# EAGLE design Adapter-IOX-test (EAGLE 7.7.0)
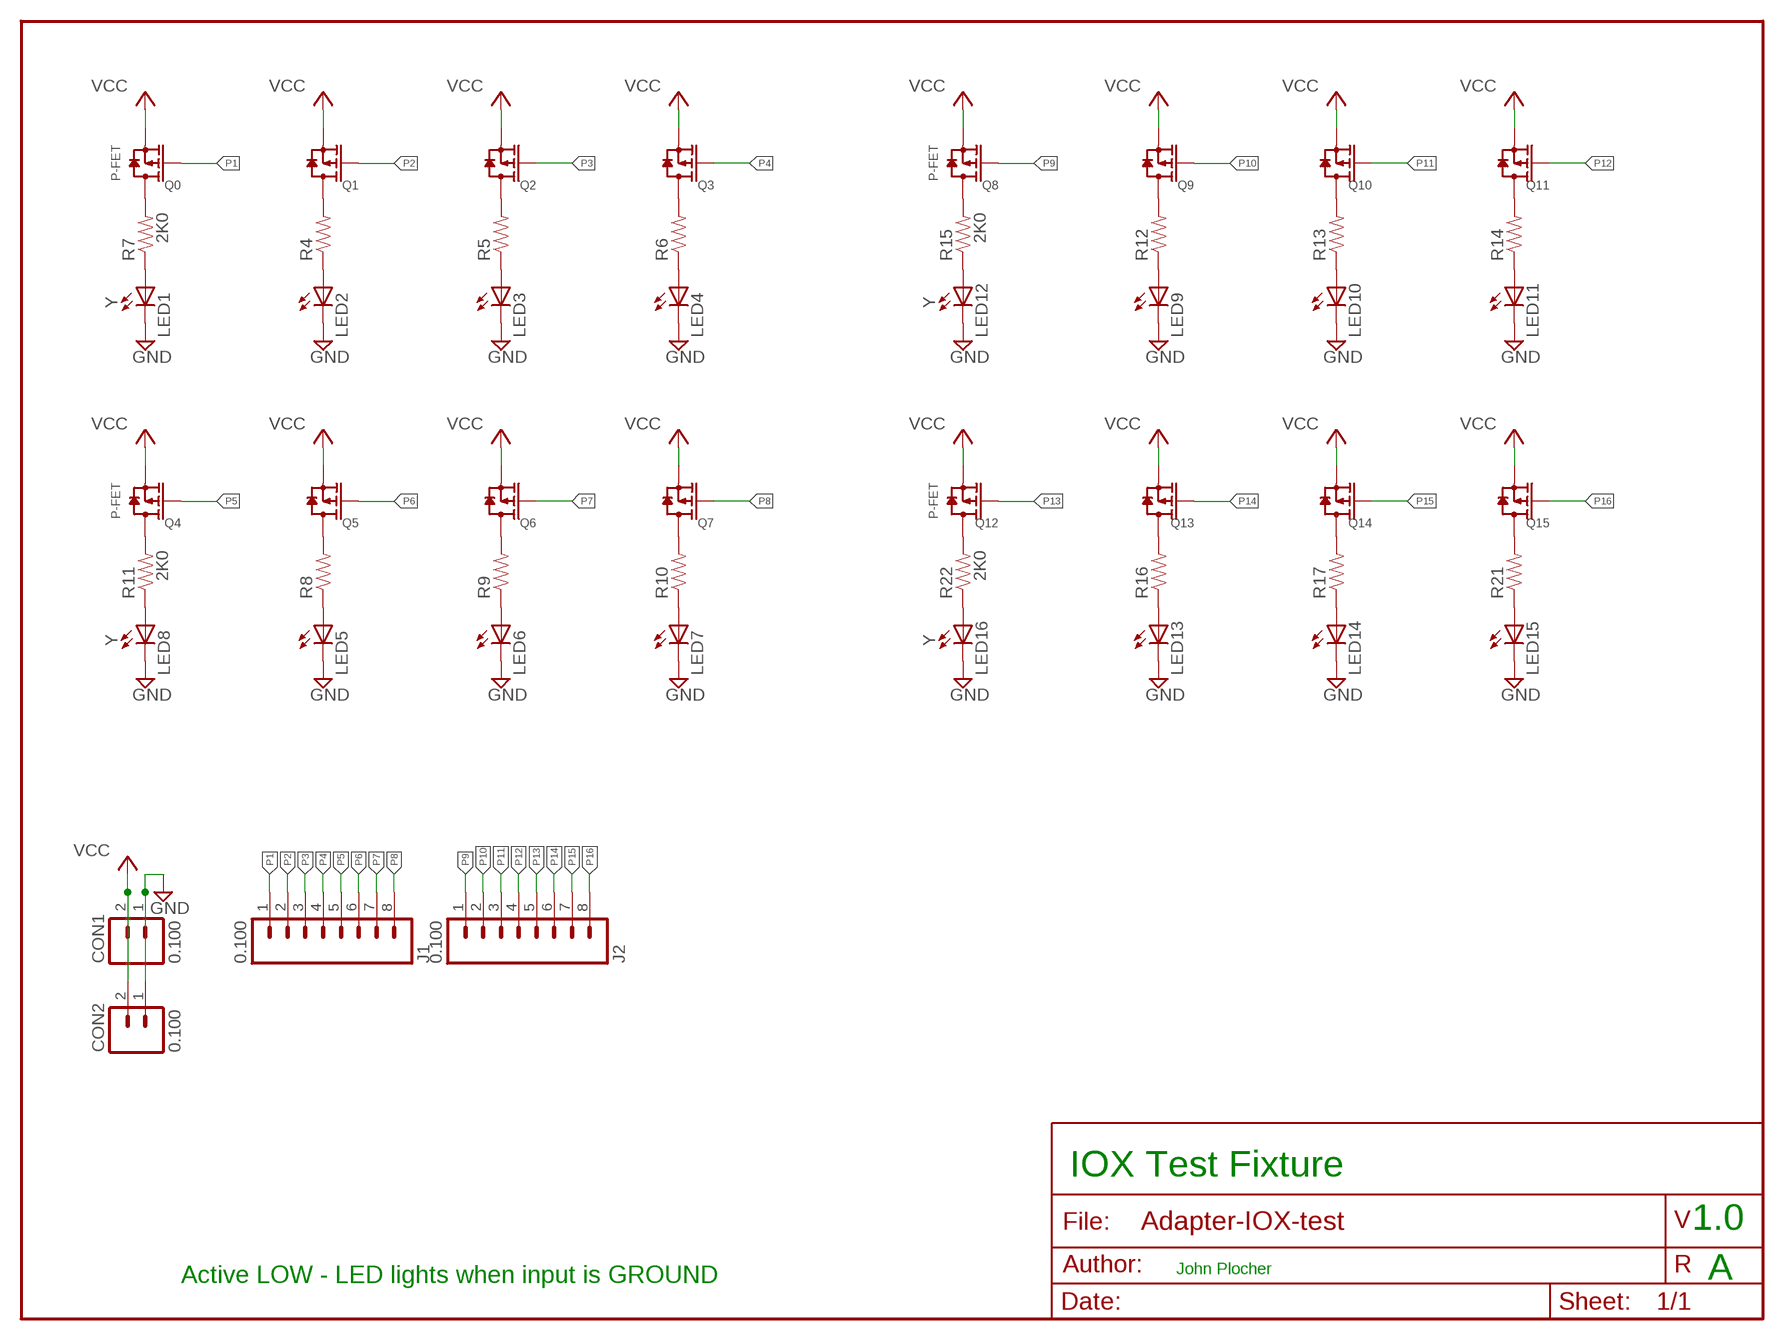
[diagram p0: schematic, sheet 1]

## Parts
CON1  0.100  CONNECTOR-M021X02-LOCK  [1X02_LOCK]
CON2  0.100  CONNECTOR-M021X02-LOCK  [1X02_LOCK]
J1  0.100  CONNECTOR-M08LOCK  [1X08_LOCK]
J2  0.100  CONNECTOR-M08LOCK  [1X08_LOCK]
LED1  Y  LED0603-LED  [0603-LED]
LED2  Y  LED0603-LED  [0603-LED]
LED3  Y  LED0603-LED  [0603-LED]
LED4  Y  LED0603-LED  [0603-LED]
LED5  Y  LED0603-LED  [0603-LED]
LED6  Y  LED0603-LED  [0603-LED]
LED7  Y  LED0603-LED  [0603-LED]
LED8  Y  LED0603-LED  [0603-LED]
LED9  Y  LED0603-LED  [0603-LED]
LED10  Y  LED0603-LED  [0603-LED]
LED11  Y  LED0603-LED  [0603-LED]
LED12  Y  LED0603-LED  [0603-LED]
LED13  Y  LED0603-LED  [0603-LED]
LED14  Y  LED0603-LED  [0603-LED]
LED15  Y  LED0603-LED  [0603-LED]
LED16  Y  LED0603-LED  [0603-LED]
Q0  P-FET  MOSFET-P-044021001  [SOT23]
Q1  P-FET  MOSFET-P-044021001  [SOT23]
Q2  P-FET  MOSFET-P-044021001  [SOT23]
Q3  P-FET  MOSFET-P-044021001  [SOT23]
Q4  P-FET  MOSFET-P-044021001  [SOT23]
Q5  P-FET  MOSFET-P-044021001  [SOT23]
Q6  P-FET  MOSFET-P-044021001  [SOT23]
Q7  P-FET  MOSFET-P-044021001  [SOT23]
Q8  P-FET  MOSFET-P-044021001  [SOT23]
Q9  P-FET  MOSFET-P-044021001  [SOT23]
Q10  P-FET  MOSFET-P-044021001  [SOT23]
Q11  P-FET  MOSFET-P-044021001  [SOT23]
Q12  P-FET  MOSFET-P-044021001  [SOT23]
Q13  P-FET  MOSFET-P-044021001  [SOT23]
Q14  P-FET  MOSFET-P-044021001  [SOT23]
Q15  P-FET  MOSFET-P-044021001  [SOT23]
R4  2K0  R0805-RES  [0805-RES]
R5  2K0  R0805-RES  [0805-RES]
R6  2K0  R0805-RES  [0805-RES]
R7  2K0  R0805-RES  [0805-RES]
R8  2K0  R0805-RES  [0805-RES]
R9  2K0  R0805-RES  [0805-RES]
R10  2K0  R0805-RES  [0805-RES]
R11  2K0  R0805-RES  [0805-RES]
R12  2K0  R0805-RES  [0805-RES]
R13  2K0  R0805-RES  [0805-RES]
R14  2K0  R0805-RES  [0805-RES]
R15  2K0  R0805-RES  [0805-RES]
R16  2K0  R0805-RES  [0805-RES]
R17  2K0  R0805-RES  [0805-RES]
R21  2K0  R0805-RES  [0805-RES]
R22  2K0  R0805-RES  [0805-RES]

## Nets
GND: CON1.1(A) CON2.1(A) LED1.C LED2.C LED3.C LED4.C LED5.C LED6.C LED7.C LED8.C LED9.C LED10.C LED11.C LED12.C LED13.C LED14.C LED15.C LED16.C
N$1: Q4.3(D) R11.2
N$3: Q5.3(D) R8.2
N$4: Q6.3(D) R9.2
N$5: Q7.3(D) R10.2
N$6: LED8.A R11.1
N$7: LED5.A R8.1
N$8: LED6.A R9.1
N$9: LED7.A R10.1
N$10: Q8.3(D) R15.2
N$11: Q9.3(D) R12.2
N$12: Q10.3(D) R13.2
N$13: Q11.3(D) R14.2
N$14: LED12.A R15.1
N$15: LED9.A R12.1
N$23: LED10.A R13.1
N$24: LED11.A R14.1
N$28: Q12.3(D) R22.2
N$29: Q13.3(D) R16.2
N$30: Q14.3(D) R17.2
N$31: Q15.3(D) R21.2
N$32: LED16.A R22.1
N$33: LED13.A R16.1
N$34: LED14.A R17.1
N$35: LED15.A R21.1
N$44: Q0.3(D) R7.2
N$45: Q1.3(D) R4.2
N$46: Q2.3(D) R5.2
N$47: Q3.3(D) R6.2
N$48: LED1.A R7.1
N$49: LED2.A R4.1
N$50: LED3.A R5.1
N$51: LED4.A R6.1
P1 [signals]: J1.1 Q0.1(G)
P2 [signals]: J1.2 Q1.1(G)
P3 [signals]: J1.3 Q2.1(G)
P4 [signals]: J1.4 Q3.1(G)
P5: J1.5 Q4.1(G)
P6: J1.6 Q5.1(G)
P7: J1.7 Q6.1(G)
P8: J1.8 Q7.1(G)
P9 [signals]: J2.1 Q8.1(G)
P10 [signals]: J2.2 Q9.1(G)
P11 [signals]: J2.3 Q10.1(G)
P12 [signals]: J2.4 Q11.1(G)
P13 [signals]: J2.5 Q12.1(G)
P14 [signals]: J2.6 Q13.1(G)
P15 [signals]: J2.7 Q14.1(G)
P16 [signals]: J2.8 Q15.1(G)
VCC [Power]: CON1.2(B) CON2.2(B) Q0.2(S) Q1.2(S) Q2.2(S) Q3.2(S) Q4.2(S) Q5.2(S) Q6.2(S) Q7.2(S) Q8.2(S) Q9.2(S) Q10.2(S) Q11.2(S) Q12.2(S) Q13.2(S) Q14.2(S) Q15.2(S)

## Notes on the sheet
- IOX Test Fixture
- 1.0
- John Plocher
- Active LOW - LED lights when input is GROUND | A

## Library data of the parts
CON1 CON2 = SPCoast:CONNECTOR-M02: PHOENIX CONNECTOR
J1 J2 = SPCoast:CONNECTOR-M08: Header 8 Standard 8-pin 0.1" header. Use with straight break away headers (SKU : PRT-00116), right angle break away headers (PRT-00553), swiss pins (PRT-00743), machine pins (PRT-00117), and female headers (PRT-00115).
LED1-LED16 = SPCoast:LED*
Q0 Q1-Q15 = SPCoast:MOSFET-P: CJ2305：SMD MOSFET P-CH 8V-4.1A
R4-R17 R21 R22 = SPCoast:R*: Resistor Basic schematic elements and footprints for 0603, 1206, and PTH 1/10th watt (small) resistors.

## Net classes
0 default: width 0.254 mm, drill 0.4 mm, clearance 0.127 mm
1 Power: width 0.254 mm, drill 0.4 mm, clearance 0.127 mm
2 signals: width 0.254 mm, drill 0.4 mm, clearance 0.127 mm

## Board
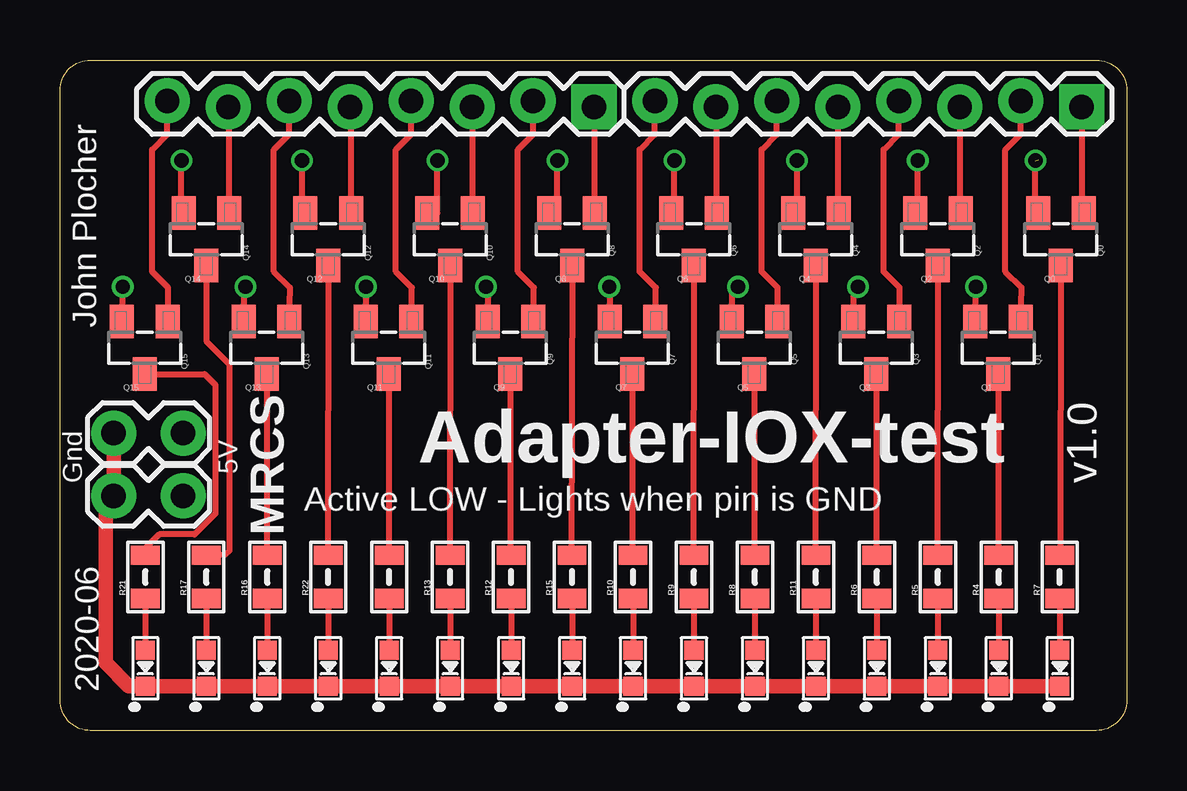
[diagram p1: board, top side]
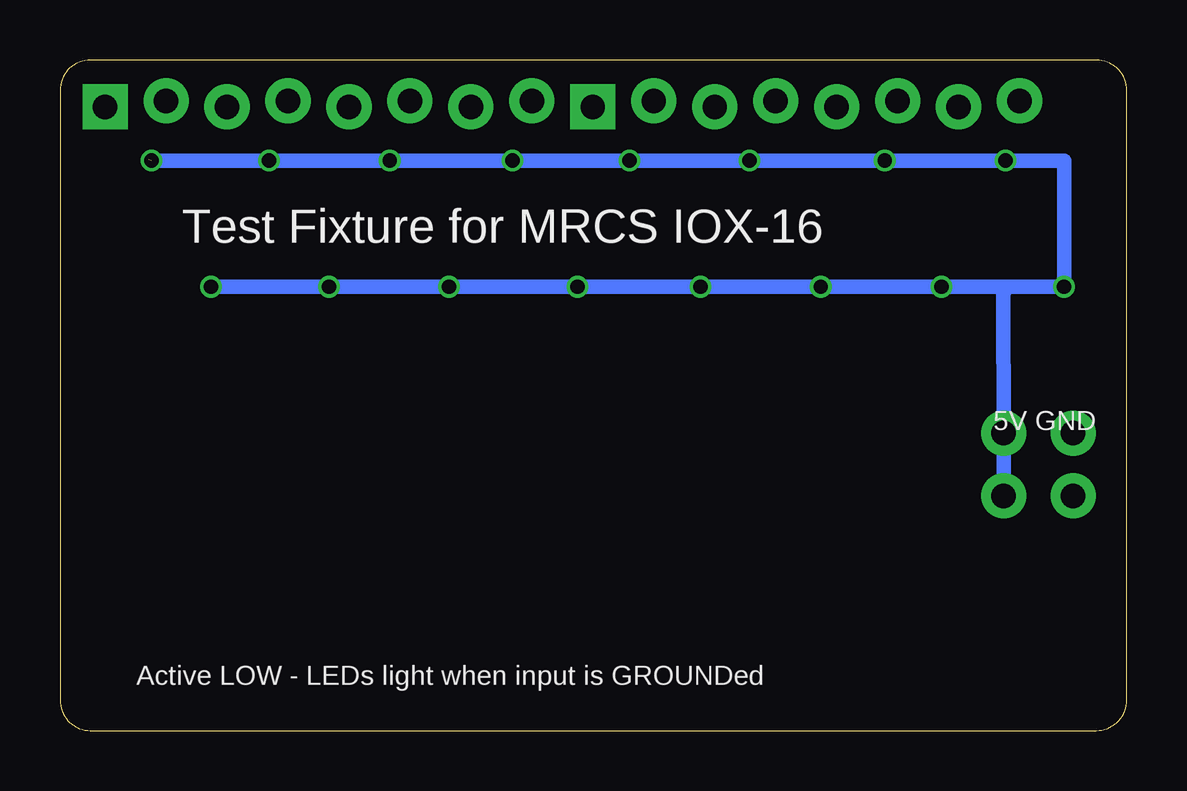
[diagram p2: board, bottom side, seen from below]

Size 44.45 x 27.94 mm. Coordinates in mm from the lower left corner, seen from the top.
Outline: 0,1.27 0,26.67 arc-90 1.27,27.94 43.18,27.94 arc-90 44.45,26.67 44.45,1.27 arc-90 43.18,0 1.27,0 arc-90 0,1.27
Copper layers (1*16): Top 0.035mm / dielectric 1.5mm / Bottom 0.035mm
Design rules "default *": minimum track width 5mil, minimum drill 0.2mm, track to track 5mil, track to pad 5mil, pad to pad 5mil, via to via 5mil, smd to smd 5mil, copper to edge 0.4mm, drill to drill 5mil, minimum pad ring 3mil, minimum via ring 3mil, stop-mask expansion 4mil, vias tented up to drill 0mil, thermal gap 10mil

### Footprints (pad centres in the part's own frame; a part is rotated, then mirrored left to right if it is on the bottom)
1X02_LOCK = drill 1.016 pad 1.88: 1 -0.178,0; 2 2.718,0
1X08_LOCK = drill 1.016 pad 1.88 square: 1 0,0.127 | drill 1.016 pad 1.88: 2 2.54,-0.127; 3 5.08,0.127; 4 7.62,-0.127; 5 10.16,0.127; 6 12.7,-0.127; 7 15.24,0.127; 8 17.78,-0.127
0603-LED = smd 0.8 x 0.8: A 0.75,0; C -0.75,0
SOT23 = smd 1.4 x 1: 1 1.1,-0.95; 2 1.1,0.95; 3 -1.1,0
0805-RES = smd 0.8 x 1.2: 1 -0.9,0; 2 0.9,0

### Placement (x,y rotation side)
CON1  2.41,12.4 0 top
CON2  2.41,9.78 0 top
J1  42.57,26.11 180 top
J2  22.25,26.11 180 top
LED1  41.66,2.59 90 top
LED2  39.12,2.59 90 top
LED3  36.58,2.59 90 top
LED4  34.04,2.59 90 top
LED5  28.96,2.59 90 top
LED6  26.42,2.59 90 top
LED7  23.88,2.59 90 top
LED8  31.5,2.59 90 top
LED9  18.8,2.59 90 top
LED10  16.26,2.59 90 top
LED11  13.72,2.59 90 top
LED12  21.34,2.59 90 top
LED13  8.64,2.59 90 top
LED14  6.1,2.59 90 top
LED15  3.56,2.59 90 top
LED16  11.18,2.59 90 top
Q0  41.71,20.47 90 top
Q1  39.09,15.95 90 top
Q2  36.58,20.47 90 top
Q3  34.01,15.95 90 top
Q4  31.5,20.47 90 top
Q5  28.93,15.95 90 top
Q6  26.42,20.47 90 top
Q7  23.85,15.95 90 top
Q8  21.34,20.47 90 top
Q9  18.77,15.95 90 top
Q10  16.26,20.47 90 top
Q11  13.69,15.95 90 top
Q12  11.18,20.47 90 top
Q13  8.61,15.95 90 top
Q14  6.1,20.47 90 top
Q15  3.53,15.95 90 top
R4  39.12,6.4 90 top
R5  36.58,6.4 90 top
R6  34.04,6.4 90 top
R7  41.66,6.4 90 top
R8  28.96,6.4 90 top
R9  26.42,6.4 90 top
R10  23.88,6.4 90 top
R11  31.5,6.4 90 top
R12  18.8,6.4 90 top
R13  16.26,6.4 90 top
R14  13.72,6.4 90 top
R15  21.34,6.4 90 top
R16  8.64,6.4 90 top
R17  6.1,6.4 90 top
R21  3.56,6.4 90 top
R22  11.18,6.4 90 top

### Tracks (layer width: path | path; a pad name or v marks a point on that pad's centre or on a via)
GND
  Top 0.61: LED1.C LED2.C LED3.C LED4.C LED8.C LED5.C LED6.C LED7.C LED12.C LED9.C LED10.C LED11.C LED16.C LED13.C LED14.C LED15.C 3.54,1.85 2.87,1.85 1.91,2.82 1.91,9.68 CON2.1 CON1.1
N$1
  Top 0.254: Q4.3 31.47,7.3 R11.2
N$3
  Top 0.254: Q5.3 28.93,7.3 R8.2
N$4
  Top 0.254: Q6.3 26.39,7.3 R9.2
N$5
  Top 0.254: Q7.3 23.85,7.3 R10.2
N$6
  Top 0.254: R11.1 LED8.A
N$7
  Top 0.254: R8.1 LED5.A
N$8
  Top 0.254: R9.1 LED6.A
N$9
  Top 0.254: R10.1 LED7.A
N$10
  Top 0.254: Q8.3 21.31,7.3 R15.2
N$11
  Top 0.254: Q9.3 18.77,7.3 R12.2
N$12
  Top 0.254: Q10.3 16.23,7.3 R13.2
N$13
  Top 0.254: Q11.3 13.69,7.3 R14.2
N$14
  Top 0.254: R15.1 LED12.A
N$15
  Top 0.254: R12.1 LED9.A
N$23
  Top 0.254: R13.1 LED10.A
N$24
  Top 0.254: R14.1 LED11.A
N$28
  Top 0.254: Q12.3 11.15,7.3 R22.2
N$29
  Top 0.254: Q13.3 8.61,7.3 R16.2
N$30
  Top 0.254: 6.07,7.3 R17.2 6.86,7.32 7.06,7.49 7.06,15.27 6.1,16.23 Q14.3
N$31
  Top 0.254: 3.53,7.3 R21.2 3.58,7.33 3.58,7.62 4.14,8.18 5.61,8.18 6.48,9.04 6.48,14.4 6.03,14.85 Q15.3
N$32
  Top 0.254: R22.1 LED16.A
N$33
  Top 0.254: R16.1 LED13.A
N$34
  Top 0.254: R17.1 LED14.A
N$35
  Top 0.254: R21.1 LED15.A
N$44
  Top 0.254: Q0.3 41.68,7.3 R7.2
N$45
  Top 0.254: Q1.3 39.09,7.3 R4.2
N$46
  Top 0.254: Q2.3 36.55,7.3 R5.2
N$47
  Top 0.254: Q3.3 34.01,7.3 R6.2
N$48
  Top 0.254: R7.1 41.66,4.23 LED1.A
N$49
  Top 0.254: R4.1 39.12,4.23 LED2.A
N$50
  Top 0.254: R5.1 LED3.A
N$51
  Top 0.254: R6.1 LED4.A
P1
  Top 0.254: J1.1 42.57,21.57 Q0.1
P2
  Top 0.254: Q1.1 40.07,18.46 39.4,19.13 39.4,24.21 40.03,24.84 J1.2
P3
  Top 0.254: J1.3 37.49,21.57 Q2.1
P4
  Top 0.254: Q3.1 34.99,18.46 34.31,19.13 34.31,24.21 34.95,24.84 J1.4
P5
  Top 0.254: J1.5 32.41,21.57 Q4.1
P6
  Top 0.254: Q5.1 29.91,18.46 29.23,19.13 29.23,24.21 29.87,24.84 J1.6
P7
  Top 0.254: Q6.1 27.37,25.98 J1.7
P8
  Top 0.254: Q7.1 24.83,18.46 24.16,19.13 24.16,24.21 24.79,24.84 J1.8
P9
  Top 0.254: Q8.1 22.29,25.98 J2.1
P10
  Top 0.254: Q9.1 19.75,18.46 19.07,19.13 19.07,24.21 19.71,24.84 J2.2
P11
  Top 0.254: Q10.1 17.21,25.98 J2.3
P12
  Top 0.254: Q11.1 14.67,18.46 13.99,19.13 13.99,24.21 14.63,24.84 J2.4
P13
  Top 0.254: Q12.1 12.13,25.98 J2.5
P14
  Top 0.254: Q13.1 9.59,18.46 8.91,19.13 8.91,24.21 9.55,24.84 J2.6
P15
  Top 0.254: Q14.1 7.05,25.98 J2.7
P16
  Top 0.254: Q15.1 4.51,18.46 3.83,19.13 3.83,24.21 4.47,24.84 J2.8
VCC  (via drill 0.6)  (1 unrouted)
  Top 0.254: 40.77,23.77 40.76,23.77 | Q0.2 40.64,21.57 v40.64,23.75 | Q2.2 35.74,21.57 v35.74,23.75 | Q4.2 30.71,21.57 v30.71,23.75 | Q6.2 25.6,21.57 v25.6,23.75 | Q8.2 20.73,21.57 v20.73,23.75 | Q10.2 15.72,21.57 v15.72,23.75 | Q12.2 10.08,21.57 v10.08,23.75 | Q14.2 5.05,21.57 v5.05,23.75 | Q15.2 2.59,17.05 v2.62,18.49 | Q1.2 v38.17,18.49 | Q13.2 7.69,18.49 v7.72,18.49 | Q11.2 12.77,18.49 v12.75,18.49 | Q9.2 17.85,18.49 v17.75,18.49 | Q7.2 22.93,18.49 v22.89,18.49 | Q5.2 28.01,18.49 v28.25,18.49 | Q3.2 33.09,18.49 v33.25,18.49
  Bottom 0.61: v40.64,23.75 v35.74,23.75 v30.71,23.75 v25.6,23.75 v20.73,23.75 v15.72,23.75 v10.08,23.75 v5.05,23.75 2.62,23.75 v2.62,18.49 5.08,18.49 | v38.17,18.49 v33.25,18.49 v28.25,18.49 v22.89,18.49 v17.75,18.49 v12.75,18.49 v7.72,18.49 5.08,18.49 | 5.08,18.49 5.16,18.16 CON1.2 CON2.2

### Text on the board
tPlace: John Plocher | MRCS | Gnd | 5V | v1.0 | Active LOW - Lights when pin is GND | 2020-06
bPlace: Test Fixture for MRCS IOX-16 | 5V GND | Active LOW - LEDs light when input is GROUNDed
_tNames: Q14 | Q12 | Q10 | Q8 | Q6 | Q4 | Q2 | Q0 | Q15 | Q13 | Q11 | Q9 | Q7 | Q5 | Q3 | Q1 | R21 | R17 | R16 | R22 | R13 | R12 | R15 | R10 | R9 | R8 | R11 | R6 | R5 | R4 | R7